# Altium schematic sheet PowerSwitch.SchDoc: Power switching
size A3; SheetNumber: 5; SheetTotal: 7
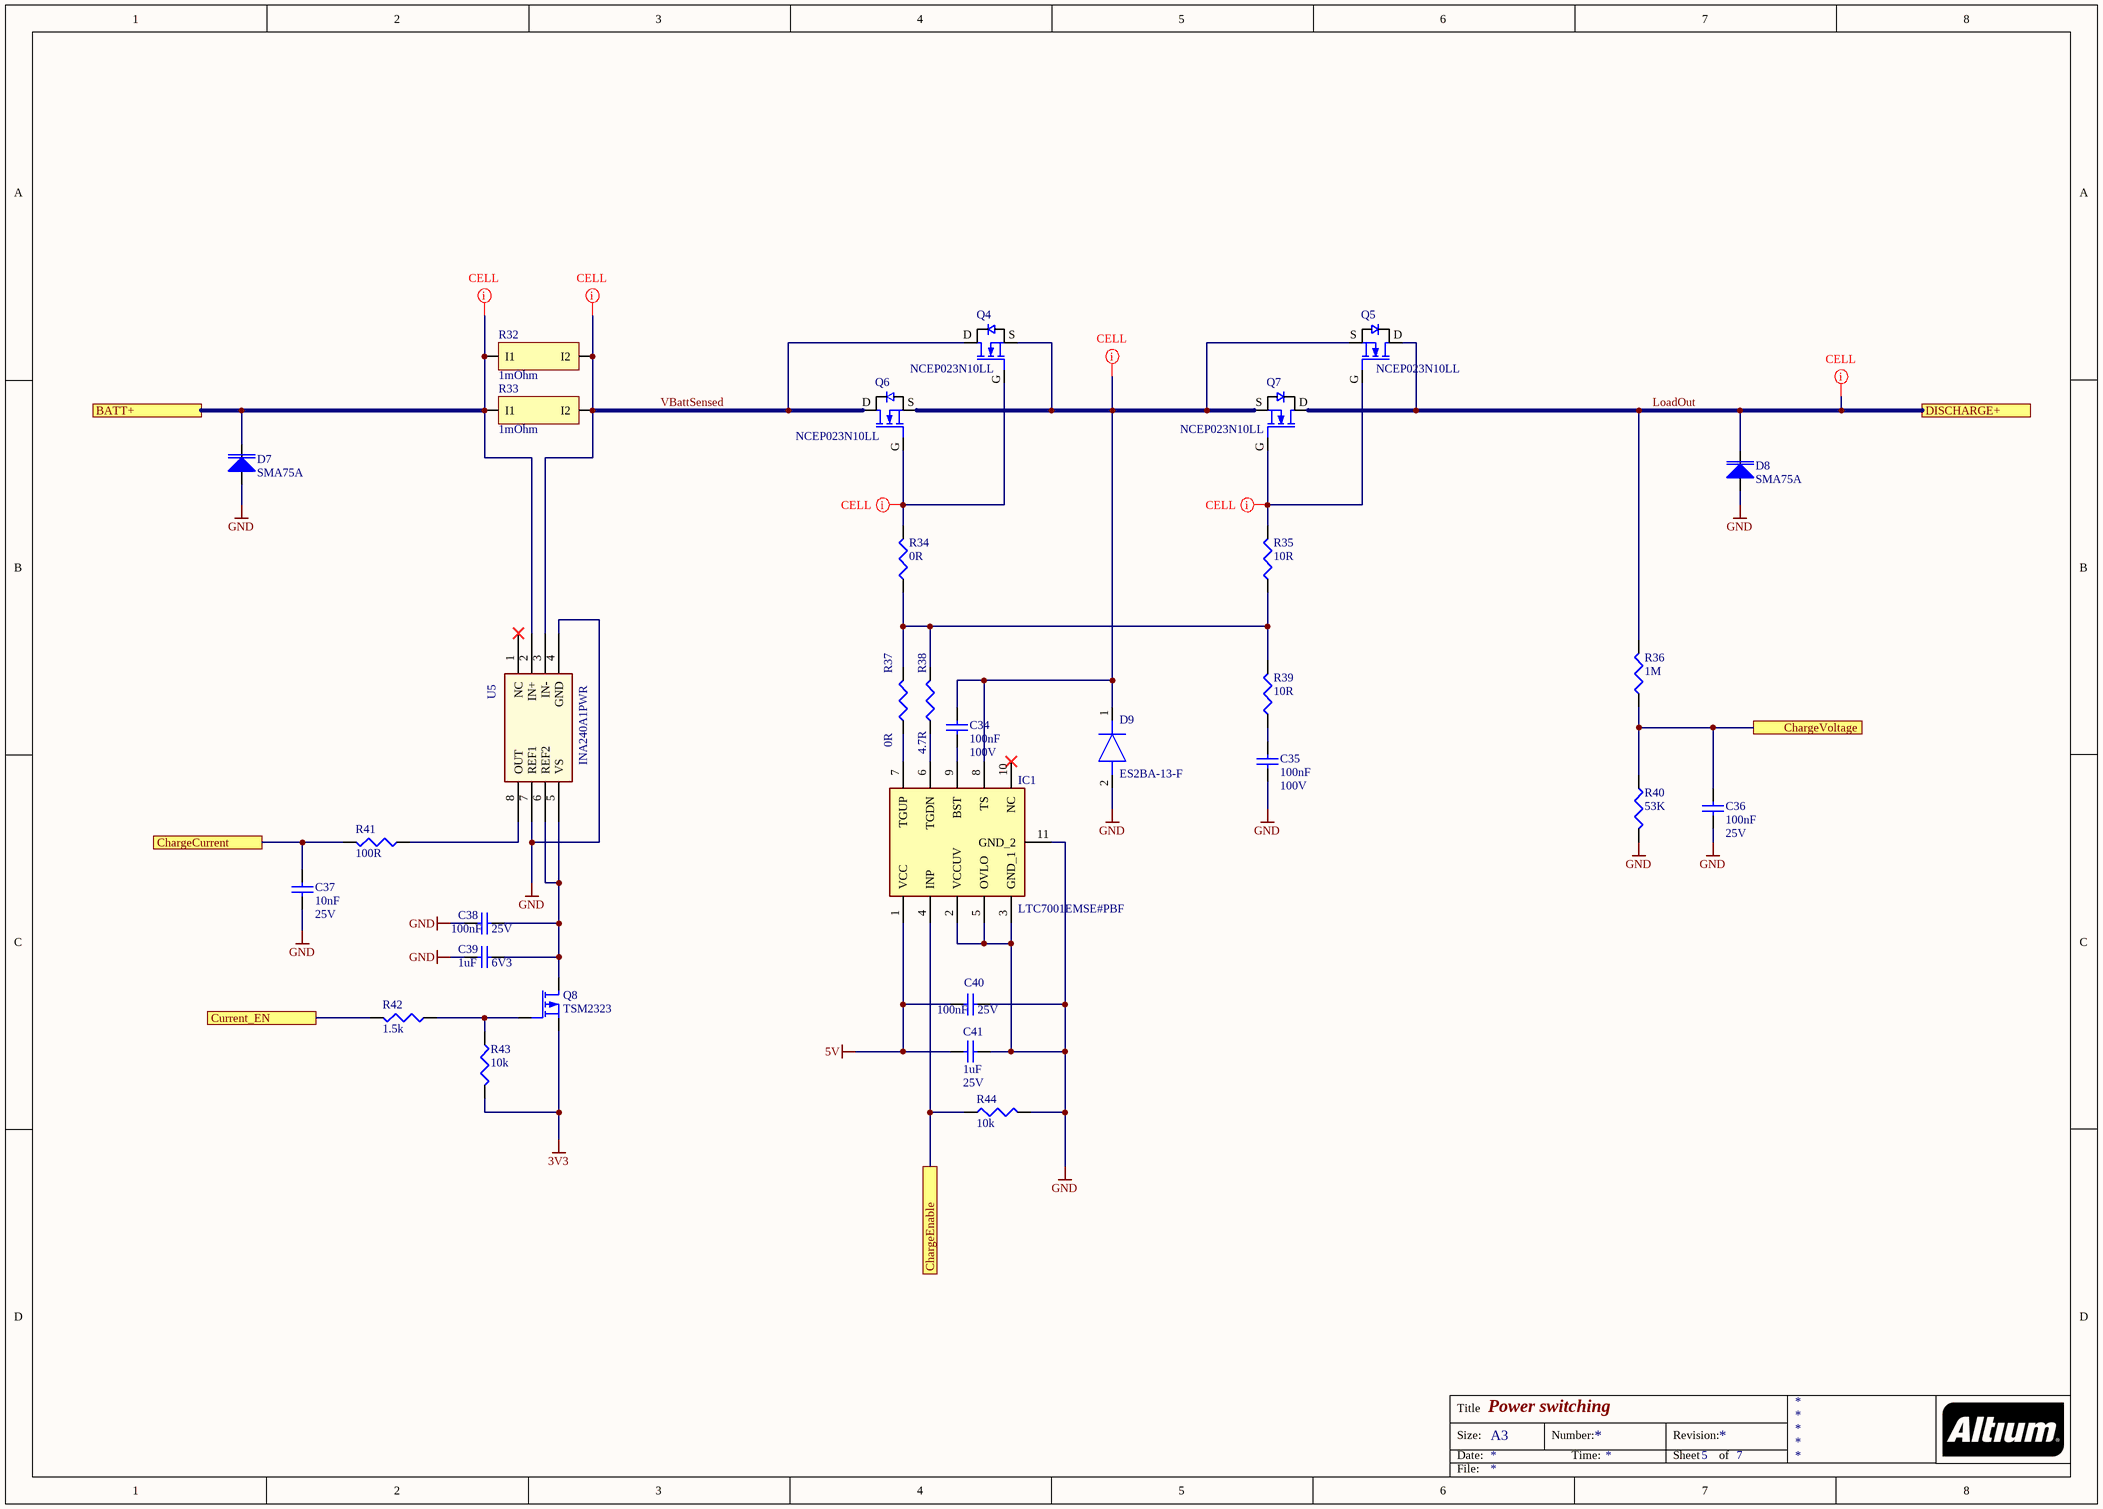
[diagram p0: PowerSwitch.SchDoc]

## Parts
C34  100nF  Voltage Rating: 100V  [C-1206]
C35  100nF  Voltage Rating: 100V  [C-1206]
C36  100nF  Voltage Rating: 25V  [C0402]
C37  10nF  Voltage Rating: 25V  [C0402]
C38  100nF  Voltage Rating: 25V  [C0402]
C39  1uF  Voltage Rating: 6V3  [C0402]
C40  100nF  Voltage Rating: 25V  [C0402]
C41  1uF  Voltage Rating: 25V  [C0402]
D7  SMA75A  [DIOM7959X262N]
D8  SMA75A  [DIOM7959X262N]
D9  ES2BA-13-F  [DIOM5226X230N]
IC1  LTC7001EMSE#PBF  [SOP50P490X110-11N]
Q4  NCEP023N10LL  [TOLL]
Q5  NCEP023N10LL  [TOLL]
Q6  NCEP023N10LL  [TOLL]
Q7  NCEP023N10LL  [TOLL]
Q8  TSM2323  [SOT-23]
R32  1mOhm  [RES-SMD_L10.0-W5.2]
R33  1mOhm  [RES-SMD_L10.0-W5.2]
R34  0R  [0603]
R35  10R  [0603]
R36  1M  [0402]
R37  0R  [0603]
R38  4.7R  [0603]
R39  10R  [0603]
R40  53K  [0402]
R41  100R  [0402]
R42  1.5k  [0402]
R43  10k  [0402]
R44  10k  [0402]
U5  INA240A1PWR  [TSSOP-8]

## Ports
BATT+, ChargeCurrent, ChargeEnable, ChargeVoltage, Current_EN, DISCHARGE+

## Nets
3V3: Q8.S R43.2
5V: C40.1 C41.2 IC1.1(VCC)
GND: C35.1 C36.1 C37.1 C38.1 C39.1 C40.2 C41.1 D7.1 D8.1 D9.2(A) IC1.2(VCCUV) IC1.3(GND_1) IC1.5(OVLO) IC1.11(GND_2) R40.2 R44.2 U5.4(GND) U5.7(REF1)
BATT+: D7.2 R32.0(I1) R33.0(I1) U5.2(IN+) ; port BATT+
ChargeCurrent: C37.2 R41.2 ; port ChargeCurrent
ChargeEnable: IC1.4(INP) R44.1 ; port ChargeEnable
ChargeVoltage: C36.2 R36.1 R40.1 ; port ChargeVoltage
Current_EN: R42.2 ; port Current_EN
LoadOut: D8.2 Q5.D Q7.D R36.2 ; port DISCHARGE+
VBattSensed: Q4.D Q6.D R32.1(I2) R33.1(I2) U5.3(IN-)
NetC34_1: C34.1 IC1.9(BST)
NetC34_2: C34.2 D9.1(K) IC1.8(TS) Q4.S Q5.S Q6.S Q7.S
NetC35_2: C35.2 R39.1
NetC38_2: C38.2 C39.2 Q8.D U5.5(VS) U5.6(REF2)
NetIC1_6: IC1.6(TGDN) R38.1
NetIC1_7: IC1.7(TGUP) R37.1
NetQ4_G: Q4.G Q6.G R34.2
NetQ5_G: Q5.G Q7.G R35.2
NetQ8_G: Q8.G R42.1 R43.1
NetR34_1: R34.1 R35.1 R37.2 R38.2 R39.2
NetR41_1: R41.1 U5.8(OUT)

Not connected (* = marked no-connect by the designer): IC1 10(NC)*; U5 1(NC)*

## Layout directives
net class CELL: BATT+, LoadOut, NetC34_2, NetQ4_G, NetQ5_G, VBattSensed

## Notes on the sheet
- Title
- Size:
- Date:
- A3
- Number:
- Time:
- Revision:
- Sheet
- of
- File:

## Library data of the parts
C34 C35 = 1uF/1206/CER/100V: Capacitor, 1uF, 100V, X7R; Capacitance Tolerance: ± 10%; Capacitor Case Style: 1206; Brand Number: 12061C105K4Z2A; Brand: AVX; Dielectric Characteristic: X7R; Capacitance: 1uF; Temperature Range: -55°C to +125°C; Price: 0,52; Order Code Supplier: 1833855; Supplier: Farnell
C36 C38 C40 C41 = 100nF/0402/CER/25V: Capacitor, 100nF, 25V, X7R; Capacitance Tolerance: 10nF; Capacitor Case Style: 0402; Brand Number: GRM155R71E104KE14D; Brand: MULTICOMP; Dielectric Characteristic: X7R; Capacitance: 100nF; Temperature Range: -55 to +125 C; Price: 0,0225; Order Code Supplier: 2456106; Supplier: Farnell
C37 = 100nF/0402/CER/25V: Capacitor, 100nF, 25V, X7R; Capacitor Case Style: 0402; Brand Number: GRM155R71E104KE14D; Brand: MULTICOMP; Dielectric Characteristic: X7R; Capacitance: 100nF; Capacitance Tolerance: 10nF; Temperature Range: -55 to +125 C; Price: 0,0225; Order Code Supplier: 2456106; Supplier: Farnell
C39 = 1uF/0402/CER/6.3V: Capacitor, 1uF, 6.3V, X5R; Capacitance Tolerance: ± 10%; Capacitor Case Style: 0402; Brand Number: 04026D105KAT2A; Brand: AVX; Dielectric Characteristic: X5R; Capacitance: 1uF; Temperature Range: -55°C to +85°C; Price: 0,0874; Order Code Supplier: 1327658; Supplier: Farnell
D7 D8 = SMA75A: Diode TVS, Vrwm: 75V, Vbr: 81.9V, Vc: 113V, Ippm: 27A; Brand: STMICROELECTRONICS; Brand Number: SMBJ70A-TR; Case Style: SMB; Vrwm: 70V; Breakdown Voltage: 81.9V; Clamping Voltage: 113V; Ippm: 27A; Order Code Supplier: 9886389; Price: 0,33; Supplier: Farnell; Temperature Range: -55°C to +150°C
D9 = ES2BA-13-F: Diode; Manufacturer_Name: Diodes Incorporated; Datasheet Link: https://www.diodes.com/assets/Datasheets/ds14002.pdf; Height: 2.3mm; Manufacturer_Part_Number: ES2BA-13-F; Mouser Part Number: 621-ES2BA-F; Mouser Price/Stock: https://www.mouser.co.uk/ProductDetail/Diodes-Incorporated/ES2BA-13-F?qs=VEnr2Ndo2sLuOIbJ1qj2iA%3D%3D; Arrow Part Number: ES2BA-13-F; Arrow Price/Stock: https://www.arrow.com/en/products/es2ba-13-f/diodes-incorporated?region=nac
IC1 = LTC7001EMSE#PBF: Integrated Circuit; Manufacturer_Name: Analog Devices; Datasheet Link: https://www.mouser.de/datasheet/2/609/LTC7001-1504282.pdf; Height: 1.1mm; Manufacturer_Part_Number: LTC7001EMSE#PBF; Mouser Part Number: 584-LTC7001EMSEPBF; Mouser Price/Stock: https://www.mouser.co.uk/ProductDetail/Analog-Devices/LTC7001EMSEPBF?qs=BZBei1rCqCDffAMQwGwGFw%3D%3D; Arrow Part Number: LTC7001EMSE#PBF; Arrow Price/Stock: https://www.arrow.com/en/products/ltc7001emsepbf/analog-devices?utm_currency=USD&region=nac
Q4-Q7 = NCEP023N10LL: Mosfet, N-channel, Vds:100V, Id:330A, Vgs-th:3.7V, Rds-on:0.00115ohm; Brand: INTERNATIONAL RECTIFIER; Brand Number: IRFS7530-7PPBF; Case Style: TO-263; Drain Current: 338A; Drain Source Voltage: 60V; Gate Source Voltage: 10V; Threshold Voltage: 3.7V; On Resistance: 0.00115ohm; Order Code Supplier: 2580027; Price: 4,40; Supplier: Farnell; Temperature Range: -55°C to +175°C; Transistor Polarity: N-Channel
Q8 = TSM2323: Mosfet, P-channel, Vds:20V, Id:4.7A, Vgs-th:1V, Rds-on:0.039ohm; Brand: Taiwan Semiconductor; Brand Number: TSM2323CX; Drain Current: 4.7A; Drain Source Voltage: 20V; Gate Source Voltage: 8V; Threshold Voltage: 1V; Case Style: SOT-23; On Resistance: 0.039ohm; Order Code Supplier: 1864590; Price: 0,195; Supplier: Farnell; Temperature Range: -55°C to +150°C; Transistor Polarity: P-channel
R32 R33 = FCSL110R001JER: 1mohm, 5 W, ± 5%, 4320 Wide; Brand: Ohmite; Order Code Supplier: 2420535; Price: 3,81; Brand Number: FCSL110R001JER; Supplier: Farnell
R34 R35 R37-R39 = 100/0603/0063W/50V: Resistor, 100R, 1%, 0.063W, 50V, 200PPM, 0603; Brand: VISHAY DRALORIC; Brand Number: CRCW0603100RFKEA; Case Style: 0603; Order Code Supplier: 2122239; Power Rating: 0.063W; Price: 0,007; Resistance: 100R; Supplier: Farnell; Temperature Coefficient: ± 200PPM; Temperature Range: -55°C to +125°C; Voltage Rating: 50V
R36 R40-R44 = 1.5k/0402/0063W/50V: Resistor, 1.5k, 0.1%, 0.0625W, 50V, 100PPM, 0402; Brand: VISHAY DRALORIC; Brand Number: CRCW04021K50FKED; Power Rating: 0.063W; Case Style: 0402; Order Code Supplier: 2121624; Price: 0,0054; Resistance: 1.5k; Supplier: Farnell; Temperature Coefficient: ± 100PPM; Temperature Range: -55°C to +125°C; Voltage Rating: 50V